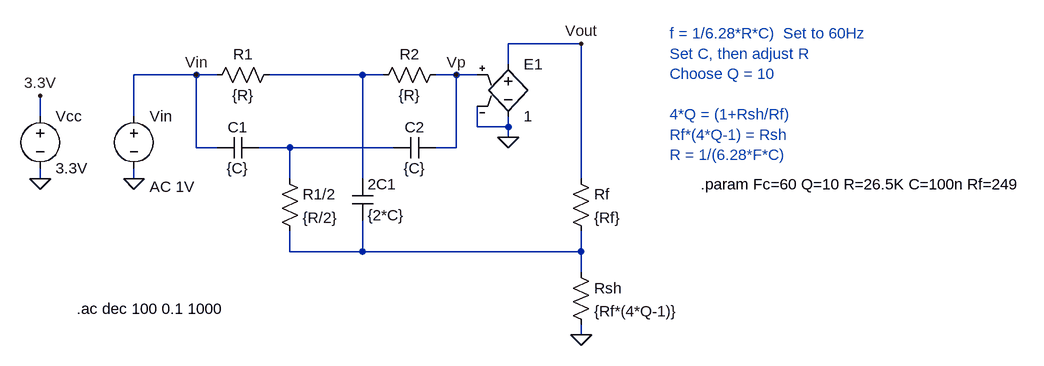
[diagram p0: schematic 60Hz_Notch_Filter_Scott.asc]
60Hz_Notch_Filter_Scott.asc, the LTspice schematic file:
Version 4
SHEET 1 1396 680
WIRE 672 128 560 128
WIRE 560 160 560 128
WIRE 80 176 -16 176
WIRE 112 176 80 176
WIRE 336 176 192 176
WIRE 368 176 336 176
WIRE 480 176 448 176
WIRE 512 176 480 176
WIRE -160 240 -160 208
WIRE -16 240 -16 176
WIRE 512 256 512 224
WIRE 560 256 560 240
WIRE 560 256 512 256
WIRE 560 272 560 256
WIRE 80 288 80 176
WIRE 112 288 80 288
WIRE 224 288 176 288
WIRE 384 288 224 288
WIRE 480 288 480 176
WIRE 480 288 448 288
WIRE -160 336 -160 320
WIRE -16 336 -16 320
WIRE 224 336 224 288
WIRE 336 336 336 176
WIRE 672 336 672 128
WIRE 224 448 224 416
WIRE 336 448 336 400
WIRE 336 448 224 448
WIRE 672 448 672 416
WIRE 672 448 336 448
WIRE 672 480 672 448
WIRE 672 576 672 560
FLAG 672 576 0
FLAG -16 336 0
FLAG -160 336 0
FLAG -160 208 3.3V
FLAG 672 128 Vout
FLAG 80 176 Vin
FLAG 480 176 Vp
FLAG 560 272 0
SYMBOL res 208 320 R0
SYMATTR InstName R1/2
SYMATTR Value {R/2}
SYMBOL res 96 192 R270
WINDOW 0 32 56 VTop 2
WINDOW 3 0 56 VBottom 2
SYMATTR InstName R1
SYMATTR Value {R}
SYMBOL res 352 192 R270
WINDOW 0 32 56 VTop 2
WINDOW 3 0 56 VBottom 2
SYMATTR InstName R2
SYMATTR Value {R}
SYMBOL res 656 320 R0
SYMATTR InstName Rf
SYMATTR Value {Rf}
SYMBOL res 656 464 R0
SYMATTR InstName Rsh
SYMATTR Value {Rf*(4*Q-1)}
SYMBOL cap 320 336 R0
SYMATTR InstName 2C1
SYMATTR Value {2*C}
SYMBOL cap 112 304 R270
WINDOW 0 32 32 VTop 2
WINDOW 3 0 32 VBottom 2
SYMATTR InstName C1
SYMATTR Value {C}
SYMBOL cap 384 304 R270
WINDOW 0 32 32 VTop 2
WINDOW 3 0 32 VBottom 2
SYMATTR InstName C2
SYMATTR Value {C}
SYMBOL voltage -16 224 R0
WINDOW 123 24 124 Left 2
WINDOW 39 0 0 Left 0
SYMATTR Value2 AC 1V
SYMATTR InstName Vin
SYMATTR Value ""
SYMBOL voltage -160 224 R0
WINDOW 123 0 0 Left 0
WINDOW 39 0 0 Left 0
SYMATTR InstName Vcc
SYMATTR Value 3.3V
SYMBOL e 560 144 R0
SYMATTR InstName E1
SYMATTR Value 1
TEXT -104 536 Left 2 !.ac dec 100 0.1 1000
TEXT 808 112 Left 2 ;f = 1/6.28*R*C)  Set to 60Hz\nSet C, then adjust R\nChoose Q = 10\n \n4*Q = (1+Rsh/Rf)\nRf*(4*Q-1) = Rsh\nR = 1/(6.28*F*C)
TEXT 856 344 Left 2 !.param Fc=60 Q=10 R=26.5K C=100n Rf=249

The netlist it stands for:
* 60Hz_Notch_Filter_Scott.asc
R1/2 N002 N003 {R/2}
R1 Vin N001 {R}
R2 N001 Vp {R}
Rf Vout N003 {Rf}
Rsh N003 0 {Rf*(4*Q-1)}
C§2C1 N001 N003 {2*C}
C1 Vin N002 {C}
C2 N002 Vp {C}
Vin Vin 0 AC 1V
Vcc 3.3V 0 3.3V
E1 Vout 0 Vp 0 1
.ac dec 100 0.1 1000
* f = 1/6.28*R*C)  Set to 60Hz
* Set C, then adjust R
* Choose Q = 10
* 4*Q = (1+Rsh/Rf)
* Rf*(4*Q-1) = Rsh
* R = 1/(6.28*F*C)
.param Fc=60 Q=10 R=26.5K C=100n Rf=249
.backanno
.end